# EAGLE design combo (EAGLE 9.1.1)
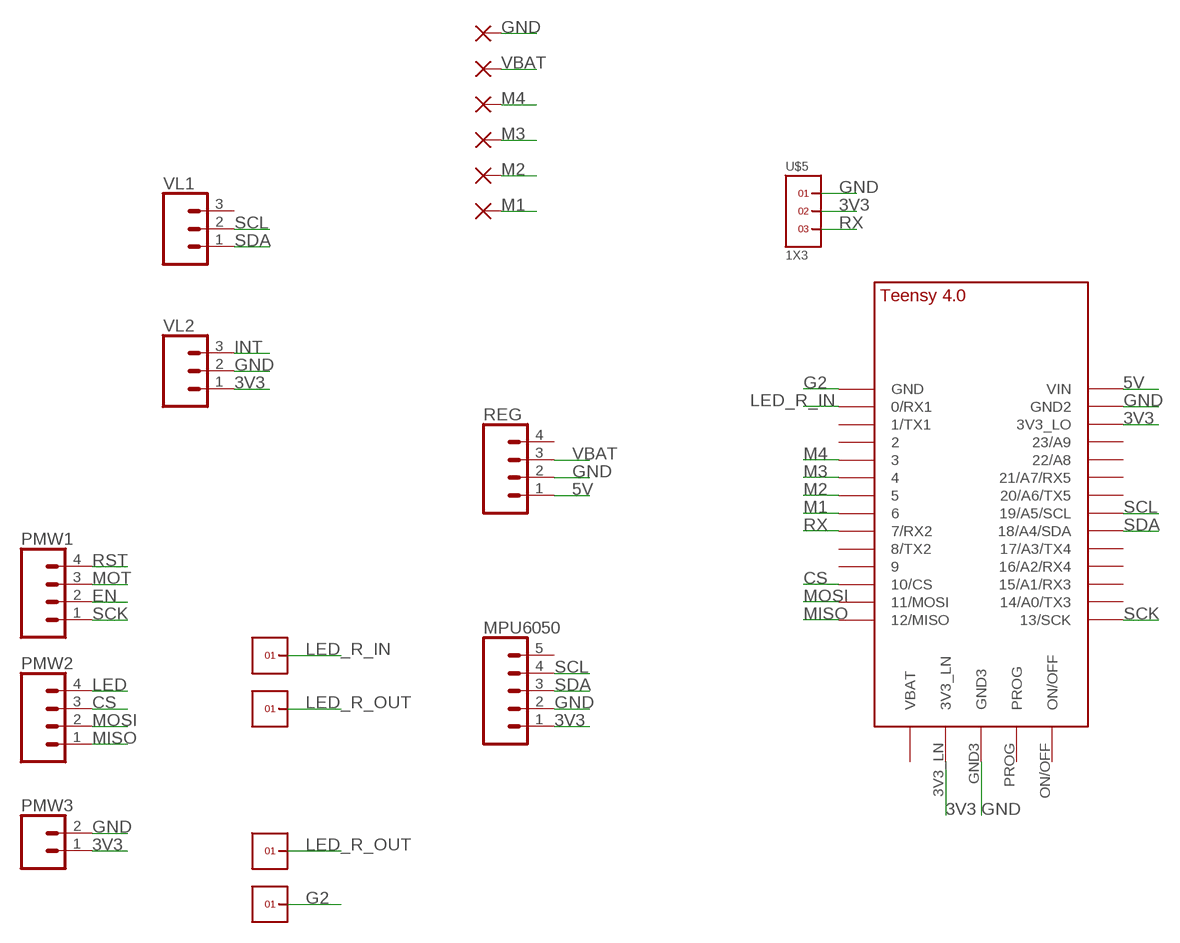
[diagram p0: schematic, sheet 1]

## Parts
GND  SMD2  [SMD1,27-2,54]
M1  SMD2  [SMD1,27-2,54]
M2  SMD2  [SMD1,27-2,54]
M3  SMD2  [SMD1,27-2,54]
M4  SMD2  [SMD1,27-2,54]
MPU6050  CONN_05NO_SILK  [1X05_NO_SILK]
PMW1  CONN_041X04_NO_SILK  [1X04_NO_SILK]
PMW2  CONN_041X04_NO_SILK  [1X04_NO_SILK]
PMW3  CONN_021X02_NO_SILK  [1X02_NO_SILK]
REG  CONN_041X04_NO_SILK  [1X04_NO_SILK]
U$1  TEENSY_4.0  [TEENSY_4.0]
U$3  1X1  [1X1]
U$4  1X1  [1X1]
U$5  1X3  [1X3]
U$6  1X1  [1X1]
U$7  1X1  [1X1]
VBAT  SMD2  [SMD1,27-2,54]
VL1  CONN_031X03_NO_SILK  [1X03_NO_SILK]
VL2  CONN_031X03_NO_SILK  [1X03_NO_SILK]

## Nets
3V3: MPU6050.1 PMW3.1 U$1.3V3_LN U$1.3V3_LO U$5.2 VL2.1
5V: REG.1 U$1.VIN
CS: PMW2.3 U$1.10/CS
EN: PMW1.2
G2: U$1.GND U$7.1
GND: GND.1(P) MPU6050.2 PMW3.2 REG.2 U$1.GND2 U$1.GND3 U$5.1 VL2.2
INT: VL2.3
LED: PMW2.4
LED_R_IN: U$1.0/RX(0/RX1) U$3.1
LED_R_OUT: U$4.1 U$6.1
M1: M1.1(P) U$1.6
M2: M2.1(P) U$1.5
M3: M3.1(P) U$1.4/CANRX
M4: M4.1(P) U$1.3/CANTX
MISO: PMW2.1 U$1.12/MISO
MOSI: PMW2.2 U$1.11/MOSI
MOT: PMW1.3
RST: PMW1.4
RX: U$1.7(7/RX2) U$5.3
SCK: PMW1.1 U$1.13/SCK
SCL: MPU6050.4 U$1.19/A5/SCL VL1.2
SDA: MPU6050.3 U$1.18/A4/SDA VL1.1
VBAT: REG.3 VBAT.1(P)
Unconnected: MPU6050.5 REG.4 U$1.1/TX(1/TX1) U$1.2 U$1.8(8/TX2) U$1.9/CS U$1.14/A0(14/A0/TX3) U$1.15/A1(15/A1/RX3) U$1.16/A2(16/A2/RX4) U$1.17/A3(17/A3/TX4) U$1.20/A6(20/A6/TX5) U$1.21/A7(21/A7/RX5) U$1.22/A8 U$1.23/A9 U$1.ON/OFF U$1.PROG U$1.VBAT\(VBAT) VL1.3

## Library data of the parts
GND M1-M4 VBAT = wirepad:SMD2: SMD PAD
MPU6050 = SparkFun-Connectors:CONN_05: Multi connection point. Often used as Generic Header-pin footprint for 0.1 inch spaced/style header connections On any of the 0.1 inch spaced packages, you can populate with these: Break Away Headers - Straight <https://www.sparkfun.com/products/116> (PRT-00116) Break Away Male Headers - Right Angle <https://www.sparkfun.com/products/553> (PRT-00553) Female Headers <https://www.sparkfun.com/products/115> (PRT-00115) Break Away Headers - Machine Pin <https://www.sparkfun.com/products/117> (PRT-00117) Break Away Female Headers - Swiss Machine Pin <https://www.sparkfun.com/products/743> (PRT-00743) For SCREWTERMINALS and SPRING TERMINALS visit here: Screw Terimnals on SparkFun.com <https://www.sparkfun.com/search/results?term=Screw+Terminals> (5mm/3.5mm/2.54mm spacing) This device is also useful as a general connection point to wire up your design to another part of your project. Our various solder wires solder well into these plated through hole pads. Hook-Up Wire - Assortment (Stranded, 22 AWG) <https://www.sparkfun.com/products/11375> (PRT-11375) Hook-Up Wire - Assortment (Solid Core, 22 AWG) <https://www.sparkfun.com/products/11367> (PRT-11367) View the entire wire category on our website here <https://www.sparkfun.com/categories/141> Special notes: Molex polarized connector foot print use with SKU : PRT-08231 with associated crimp pins and housings. 1MM SMD Version SKU: PRT-10208
PMW1 PMW2 REG = SparkFun-Connectors:CONN_04: Multi connection point. Often used as Generic Header-pin footprint for 0.1 inch spaced/style header connections On any of the 0.1 inch spaced packages, you can populate with these: Break Away Headers - Straight <https://www.sparkfun.com/products/116> (PRT-00116) Break Away Male Headers - Right Angle <https://www.sparkfun.com/products/553> (PRT-00553) Female Headers <https://www.sparkfun.com/products/115> (PRT-00115) Break Away Headers - Machine Pin <https://www.sparkfun.com/products/117> (PRT-00117) Break Away Female Headers - Swiss Machine Pin <https://www.sparkfun.com/products/743> (PRT-00743) For SCREWTERMINALS and SPRING TERMINALS visit here: Screw Terimnals on SparkFun.com <https://www.sparkfun.com/search/results?term=Screw+Terminals> (5mm/3.5mm/2.54mm spacing) This device is also useful as a general connection point to wire up your design to another part of your project. Our various solder wires solder well into these plated through hole pads. Hook-Up Wire - Assortment (Stranded, 22 AWG) <https://www.sparkfun.com/products/11375> (PRT-11375) Hook-Up Wire - Assortment (Solid Core, 22 AWG) <https://www.sparkfun.com/products/11367> (PRT-11367) View the entire wire category on our website here <https://www.sparkfun.com/categories/141> Special notes: Molex polarized connector foot print use with SKU : PRT-08231 with associated crimp pins and housings. 1MM SMD Version SKU: PRT-10208; PROD_ID: CONN-09696
PMW3 = SparkFun-Connectors:CONN_02: Multi connection point. Often used as Generic Header-pin footprint for 0.1 inch spaced/style header connections On any of the 0.1 inch spaced packages, you can populate with these: Break Away Headers - Straight <https://www.sparkfun.com/products/116> (PRT-00116) Break Away Male Headers - Right Angle <https://www.sparkfun.com/products/553> (PRT-00553) Female Headers <https://www.sparkfun.com/products/115> (PRT-00115) Break Away Headers - Machine Pin <https://www.sparkfun.com/products/117> (PRT-00117) Break Away Female Headers - Swiss Machine Pin <https://www.sparkfun.com/products/743> (PRT-00743) For SCREWTERMINALS and SPRING TERMINALS visit here: Screw Terimnals on SparkFun.com <https://www.sparkfun.com/search/results?term=Screw+Terminals> (5mm/3.5mm/2.54mm spacing) This device is also useful as a general connection point to wire up your design to another part of your project. Our various solder wires solder well into these plated through hole pads. Hook-Up Wire - Assortment (Stranded, 22 AWG) <https://www.sparkfun.com/products/11375> (PRT-11375) Hook-Up Wire - Assortment (Solid Core, 22 AWG) <https://www.sparkfun.com/products/11367> (PRT-11367) View the entire wire category on our website here <https://www.sparkfun.com/categories/141> Special notes: Molex polarized connector foot print use with: PRT-08233 with associated crimp pins and housings. 2.54_SCREWTERM for use with PRT-10571. 3.5mm Screw Terminal footprints for PRT-08084 5mm Screw Terminal footprints for use with PRT-08432
U$1 = TEENSY 4.0:TEENSY_4.0
U$3 U$4 U$6 U$7 = headers(2mm):1X1
U$5 = headers(2mm):1X3
VL1 VL2 = SparkFun-Connectors:CONN_03: Multi connection point. Often used as Generic Header-pin footprint for 0.1 inch spaced/style header connections On any of the 0.1 inch spaced packages, you can populate with these: Break Away Headers - Straight <https://www.sparkfun.com/products/116> (PRT-00116) Break Away Male Headers - Right Angle <https://www.sparkfun.com/products/553> (PRT-00553) Female Headers <https://www.sparkfun.com/products/115> (PRT-00115) Break Away Headers - Machine Pin <https://www.sparkfun.com/products/117> (PRT-00117) Break Away Female Headers - Swiss Machine Pin <https://www.sparkfun.com/products/743> (PRT-00743) Stackable Header - 3 Pin (Female, 0.1") <https://www.sparkfun.com/products/13875> (PRT-13875) For SCREWTERMINALS and SPRING TERMINALS visit here: Screw Terimnals on SparkFun.com <https://www.sparkfun.com/search/results?term=Screw+Terminals> (5mm/3.5mm/2.54mm spacing) This device is also useful as a general connection point to wire up your design to another part of your project. Our various solder wires solder well into these plated through hole pads. Hook-Up Wire - Assortment (Stranded, 22 AWG) <https://www.sparkfun.com/products/11375> (PRT-11375) Hook-Up Wire - Assortment (Solid Core, 22 AWG) <https://www.sparkfun.com/products/11367> (PRT-11367) View the entire wire category on our website here <https://www.sparkfun.com/categories/141> Special notes: Molex polarized connector foot print use with SKU : PRT-08232 with associated crimp pins and housings.

## Board
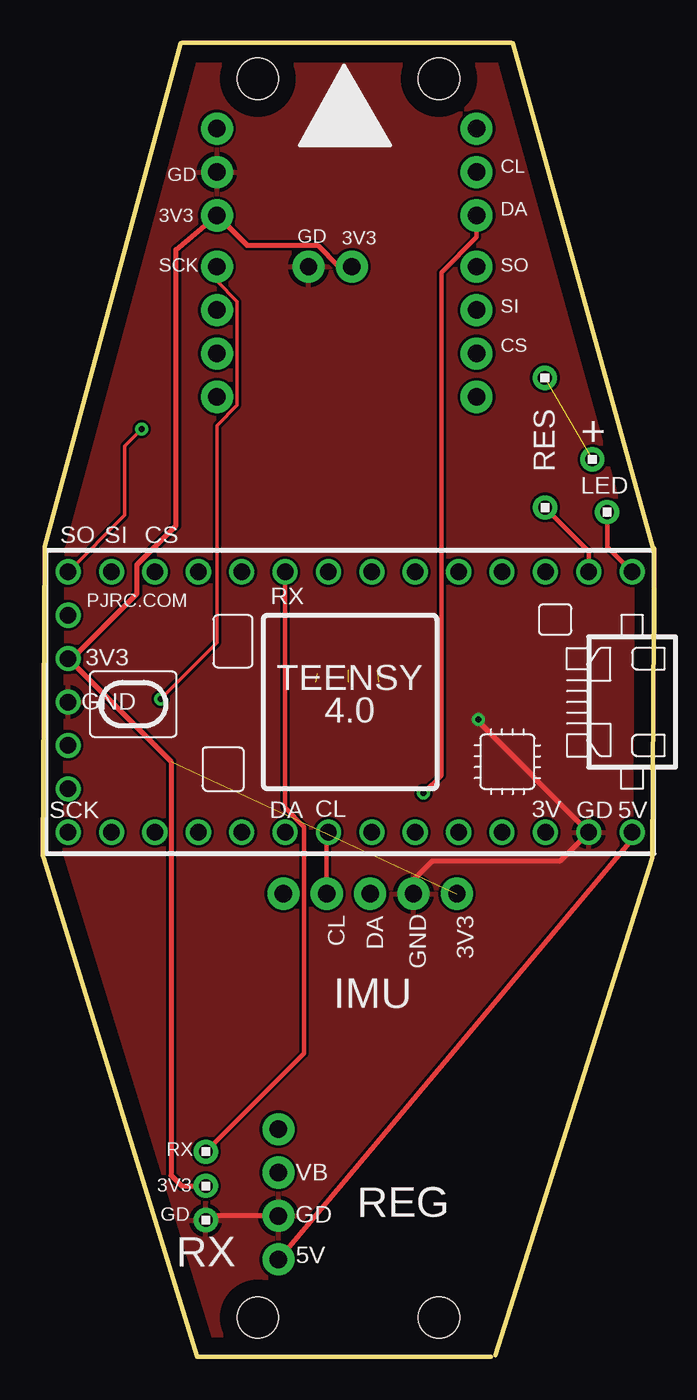
[diagram p1: board, top side]
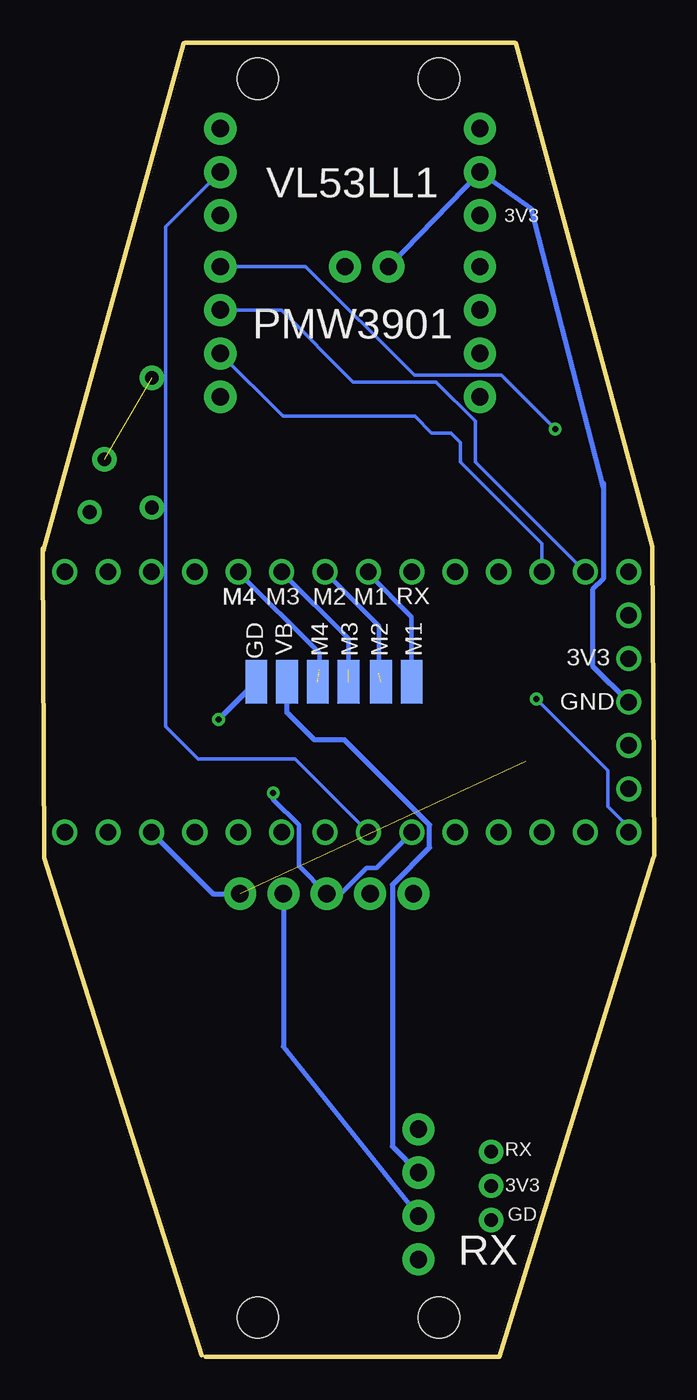
[diagram p2: board, bottom side, seen from below]

Size 35.8 x 76.91 mm. Coordinates in mm from the lower left corner, seen from the top.
Outline: 26.25,0 9.05,0 0.05,29.2
Outline: 8.08,76.88 0.12,47.42 0,29.3
Outline: 35.8,47.3 35.7,29.2 26.5,0.1
Outline: 27.54,76.88 35.78,47.15
Outline: 8.15,76.91 27.45,76.91
Copper layers (1*16): Top 0.035mm / dielectric 1.5mm / Bottom 0.035mm
Design rules "default": minimum track width 6mil, minimum drill 0.35mm, track to track 6mil, track to pad 6mil, pad to pad 6mil, via to via 6mil, smd to smd 6mil, copper to edge 40mil, drill to drill 6mil, minimum pad ring 10mil, minimum via ring 8mil, stop-mask expansion 4mil, vias tented up to drill 0mil, thermal gap 10mil
Holes 2.4 mm at 12.6,74.8 23.2,74.8 12.6,2.3 23.2,2.3

### Footprints (pad centres in the part's own frame; a part is rotated, then mirrored left to right if it is on the bottom)
SMD1,27-2,54 = smd 1.27 x 2.54: 1 0,0
1X05_NO_SILK = drill 1.016 pad 1.88: 1 0,0; 2 2.54,0; 3 5.08,0; 4 7.62,0; 5 10.16,0
1X04_NO_SILK = drill 1.016 pad 1.88: 1 0,0; 2 2.54,0; 3 5.08,0; 4 7.62,0
1X02_NO_SILK = drill 1.016 pad 1.88: 1 0,0; 2 2.54,0
TEENSY_4.0 = drill 0.965: 0/RX -13.97,-7.62; 1/TX -11.43,-7.62; 2 -8.89,-7.62; 3/CANTX -6.35,-7.62; 3V3_LN 16.51,-2.54; 3V3_LO -11.43,7.62; 4/CANRX -3.81,-7.62; 5 -1.27,-7.62; 6 1.27,-7.62; 7 3.81,-7.62; 8 6.35,-7.62; 9/CS 8.89,-7.62; 10/CS 11.43,-7.62; 11/MOSI 13.97,-7.62; 12/MISO 16.51,-7.62; 13/SCK 16.51,7.62; 14/A0 13.97,7.62; 15/A1 11.43,7.62; 16/A2 8.89,7.62; 17/A3 6.35,7.62; 18/A4/SDA 3.81,7.62; 19/A5/SCL 1.27,7.62; 20/A6 -1.27,7.62; 21/A7 -3.81,7.62; 22/A8 -6.35,7.62; 23/A9 -8.89,7.62; GND -16.51,-7.62; GND2 -13.97,7.62; GND3 16.51,0; ON/OFF 16.51,5.08; PROG 16.51,2.54; VBAT\ 16.51,-5.08; VIN -16.51,7.62
1X1 = drill 0.8 pad 1.422: 1 0,0
1X3 = drill 0.8 pad 1.422: 1 -2,0; 2 0,0; 3 2,0
1X03_NO_SILK = drill 1.016 pad 1.88: 1 0,0; 2 2.54,0; 3 5.08,0

### Placement (x,y rotation side)
GND  23.3,39.5 0 bottom
M1  14.2,39.5 0 bottom
M2  16,39.5 0 bottom
M3  17.9,39.5 0 bottom
M4  19.7,39.5 0 bottom
MPU6050  24.25,27.1 180 top
PMW1  10.2,63.8 270 top
PMW2  25.4,63.8 270 top
PMW3  18.1,63.8 180 top
REG  13.8,5.7 90 top
U$1  18,38.32 180 top
U$3  29.41,49.7 0 top
U$4  29.4,57.3 0 top
U$5  9.55,10 90 top
U$6  32.18,52.53 0 top
U$7  33.05,49.44 0 top
VBAT  21.5,39.5 0 bottom
VL1  25.4,66.8 90 top
VL2  10.2,66.8 90 top

### Tracks (layer width: path | path; a pad name or v marks a point on that pad's centre or on a via)
3V3  (1 unrouted)
  Top 0.305: PMW3.1 17.32,63.8 16.08,65.05 11.96,65.05 VL2.1 7.8,64.8 7.8,48.64 5.53,46.37 5.53,44.66 1.73,40.86 U$1.3V3_LN 7.51,34.84 7.51,10.61 8.12,10 U$5.2
  Bottom 0.305: U$1.3V3_LO 25.83,27.1 MPU6050.1
5V
  Top 0.305: REG.1 34.49,30.29 34.54,30.29 34.54,30.67 U$1.VIN
CS
  Bottom 0.203: PMW2.3 21.72,55.04 14.02,55.04 13.04,54.06 11.9,54.06 11.34,53.5 11.34,52.36 6.57,47.59 U$1.10/CS
G2
  Top 0.254: U$1.GND 33.05,47.4 U$7.1
GND  (via drill 0.35)
  Top 0.305: MPU6050.2 21.71,27.91 22.8,29 30.27,29 U$1.GND2 25.5,37.17 v25.5,37.3 | REG.2 9.79,8.24 U$5.1
  Bottom 0.305: U$1.GND3 3.61,40.44 3.61,44.89 2.99,45.51 2.99,50.9 | 2.99,51.15 2.99,50.9 | 2.99,50.9 7.2,67.2 VL2.2 PMW3.2 | MPU6050.2 21.71,18.15 REG.2 | v25.5,37.3 GND.1
  pour Top: 41.25,79.66 41.25,-1.85 -5.5,-1.85 -5.5,79.66
LED_R_IN
  Top 0.254: U$3.1 31.97,47.14 U$1.0/RX
LED_R_OUT  (1 unrouted)
M1
  Bottom 0.254: U$1.6 16.73,45.83 14.2,43.3 M1.1
M2  (1 unrouted)
  Bottom 0.254: U$1.5 16.1,42.77 16.1,40
M3  (1 unrouted)
  Bottom 0.254: U$1.4/CANRX 17.9,42.03 17.9,40.2
M4  (1 unrouted)
  Bottom 0.254: U$1.3/CANTX 19.6,41.19 19.6,40.2
MISO  (via drill 0.35)
  Top 0.203: v5.8,54.3 4.8,53.3 4.8,49.25 U$1.12/MISO
  Bottom 0.203: PMW2.1 20.4,63.8 14.05,57.45 8.95,57.45 v5.8,54.3
  Bottom 0.254: 25.4,63.68 PMW2.1
MOSI
  Bottom 0.203: 25.38,61.28 PMW2.2 21.83,61.26 17.62,57.05 12.76,57.05 10.47,54.76 10.47,52.38 U$1.11/MOSI
RX
  Top 0.254: U$1.7 14.19,32.14 15.31,31.02 15.31,17.76 U$5.3
SCK  (via drill 0.35)
  Top 0.203: v6.9,38.5 10.2,41.8 10.2,54.49 11.39,55.69 11.39,61.75 10.2,62.95 PMW1.1
  Bottom 0.203: v6.9,38.5 2.7,34.3 2.7,32.2 1.49,30.99 U$1.13/SCK
SCL
  Top 0.254: U$1.19/A5/SCL 16.63,30.6 MPU6050.4
  Bottom 0.203: VL1.2 28.6,66.14 28.6,36.9 26.7,35 21.03,35 U$1.19/A5/SCL
SDA  (via drill 0.35)
  Top 0.254: VL1.1 25.4,65.52 23.33,63.46 23.33,34.03 v22.3,33
  Bottom 0.254: U$1.18/A4/SDA 16.27,28.62 16.83,28.62 18.35,27.1 MPU6050.3 20.79,28.72 20.79,31.12 22.3,32.63 v22.3,33
VBAT
  Bottom 0.305: REG.3 15.34,12.32 15.34,27.62 13.15,29.8 13.15,31.13 18.12,36.1 19.9,36.1 21.5,37.7 VBAT.1

### Text on the board
tNames: CL | GD | 3V3 | DA | GD | 3V3 | SCK | SO | SI | CS | + | RES | LED | SO | SI | CS | RX | 3V3 | GND | DA | CL | 3V | 5V | SCK | GD | CL | DA | GND | 3V3 | IMU | RX | VB | REG | 3V3 | GD | GD | RX | 5V
bNames: VL53LL1 | 3V3 | PMW3901 | RX | M1 | M2 | M3 | M4 | M4 | M1 | M2 | M3 | M4 | VB | GD | 3V3 | GND | RX | 3V3 | GD | RX